# Altium project A4v3.PrjPcb
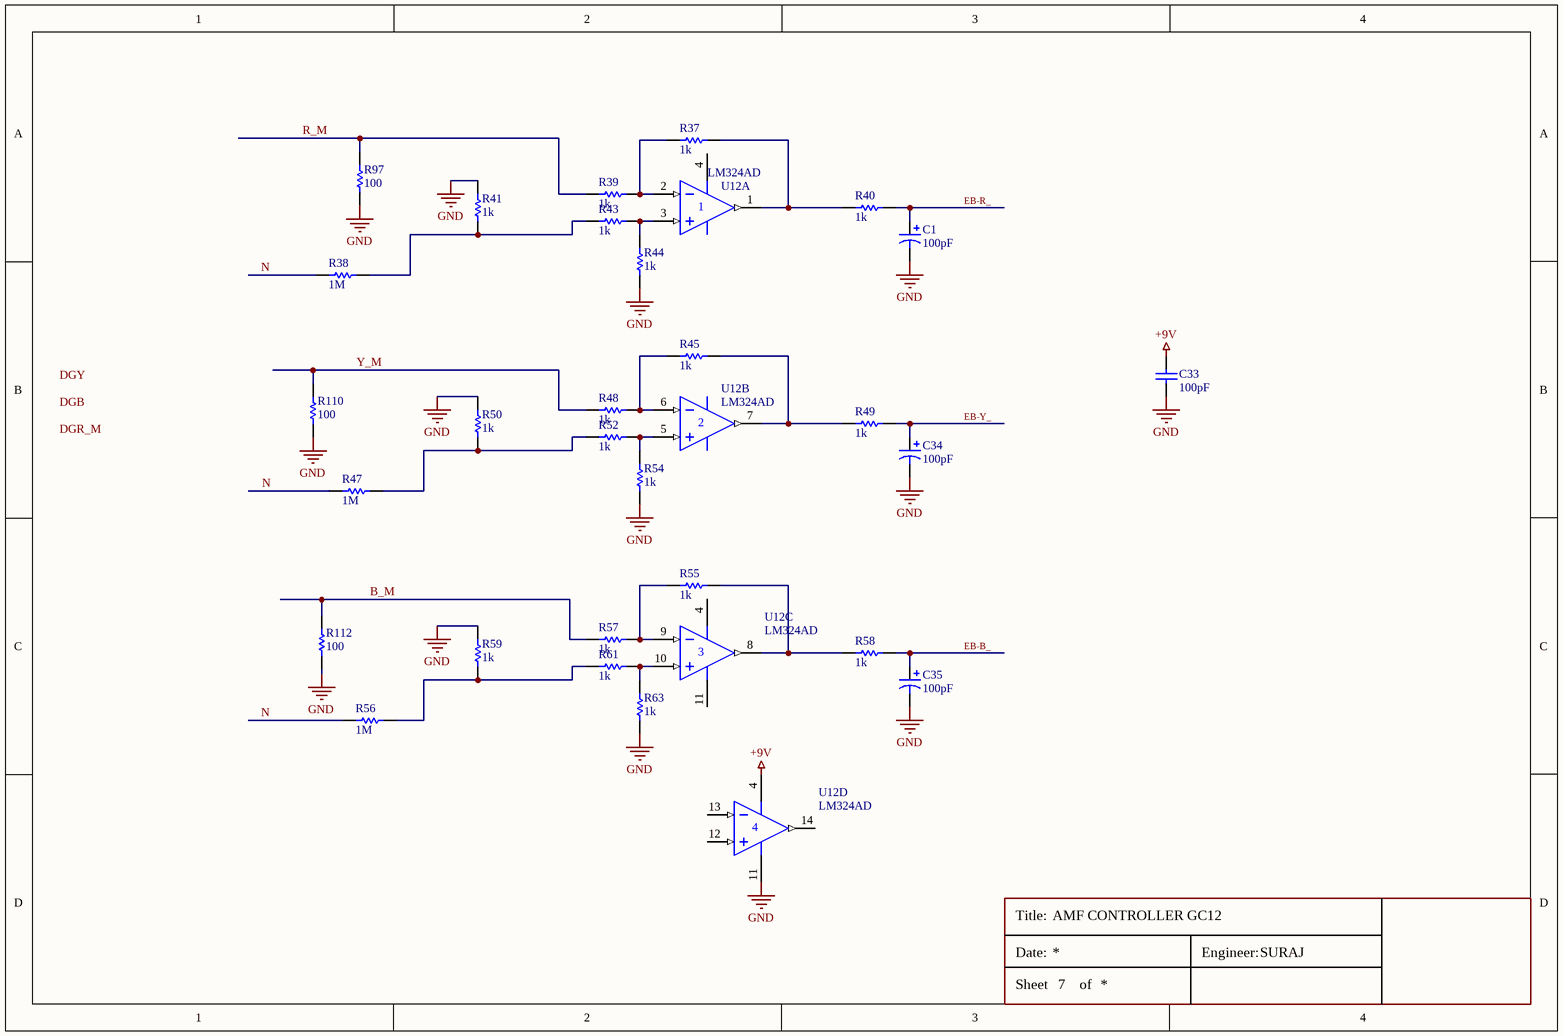
[diagram p0: AC.SchDoc]
4 sheets, 93 parts. Net scope: global (net labels, ports and power ports of the same name join across sheets).
Board file: A4.PcbDoc
Sheets:
  AC.SchDoc
  AC2.SchDoc
  BOTTOM.SchDoc
  SUPPLY.SchDoc

## Sheet AC.SchDoc: AMF CONTROLLER GC12
size A4; DrawnBy: SURAJ; Engineer: SURAJ; SheetNumber: 7

### Parts
C1  value 100pF  [Cap_.1]  (hidden comment: 10uF/63V)
C33  value 100pF  [C1206VW]  (hidden comment: .1uF 1206)
C34  value 100pF  [Cap_.1]  (hidden comment: 10uF/63V)
C35  value 100pF  [Cap_.1]  (hidden comment: 10uF/63V)
R37  value 1k  [R1206VW]  (hidden comment: 1M 1206)
R38  value 1M  [RES_RAD_1W]  (hidden comment: 1M MFR)
R39  value 1k  [R1206VW]  (hidden comment: 220K 1206)
R40  value 1k  [R1206VW]  (hidden comment: 33K 1206)
R41  value 1k  [R1206VW]  (hidden comment: 4.7K 1206)
R43  value 1k  [R1206VW]  (hidden comment: 220K 1206)
R44  value 1k  [R1206VW]  (hidden comment: 1M 1206)
R45  value 1k  [R1206VW]  (hidden comment: 1M 1206)
R47  value 1M  [RES_RAD_1W]  (hidden comment: 1M MFR)
R48  value 1k  [R1206VW]  (hidden comment: 220K 1206)
R49  value 1k  [R1206VW]  (hidden comment: 33K 1206)
R50  value 1k  [R1206VW]  (hidden comment: 4.7K 1206)
R52  value 1k  [R1206VW]  (hidden comment: 220K 1206)
R54  value 1k  [R1206VW]  (hidden comment: 1M 1206)
R55  value 1k  [R1206VW]  (hidden comment: 1M 1206)
R56  value 1M  [RES_RAD_1W]  (hidden comment: 1M MFR)
R57  value 1k  [R1206VW]  (hidden comment: 220K 1206)
R58  value 1k  [R1206VW]  (hidden comment: 33K 1206)
R59  value 1k  [R1206VW]  (hidden comment: 4.7K 1206)
R61  value 1k  [R1206VW]  (hidden comment: 220K 1206)
R63  value 1k  [R1206VW]  (hidden comment: 1M 1206)
R97  value 100  [R1206VW]  (hidden comment: 4.7K 1206)
R110  value 100  [R1206VW]  (hidden comment: 4.7K 1206)
R112  value 100  [R1206VW]  (hidden comment: 4.7K 1206)
U12  LM324AD  [D014_M]  (parts A,B,C,D of 4)

### Nets
+9V: C33.2 U12.4(V+)
GND: C1.2 C33.1 C34.2 C35.2 R41.2 R44.1 R50.2 R54.1 R59.2 R63.1 R97.1 R110.1 R112.1 U12.11(V-)
B_M: R57.2 R112.2
EB-B_: C35.1 R58.1
EB-R_: C1.1 R40.1
EB-Y_: C34.1 R49.1
N: R38.1 R47.1 R56.1
R_M: R39.2 R97.2
Y_M: R48.2 R110.2
NetR37_1: R37.1 R40.2 U12.1(OUT)
NetR37_2: R37.2 R39.1 U12.2(IN-)
NetR38_2: R38.2 R41.1 R43.2
NetR43_1: R43.1 R44.2 U12.3(IN+)
NetR45_1: R45.1 R49.2 U12.7(OUT)
NetR45_2: R45.2 R48.1 U12.6(IN-)
NetR47_2: R47.2 R50.1 R52.2
NetR52_1: R52.1 R54.2 U12.5(IN+)
NetR55_1: R55.1 R58.2 U12.8(OUT)
NetR55_2: R55.2 R57.1 U12.9(IN-)
NetR56_2: R56.2 R59.1 R61.2
NetR61_1: R61.1 R63.2 U12.10(IN+)

Not connected (* = marked no-connect by the designer): U12 12(IN+) 13(IN-) 14(OUT)

### Notes on the sheet
- Labels drawn without touching a wire or pin: DGB, DGR_M, DGY
- Title:
- Date:
- Sheet
- of
- Engineer:

### Library data of the parts
C1 C34 C35 = Cap Pol1: Polarized Capacitor (Radial); Published: 8-Jun-2000; LatestRevisionDate: 17-Jul-2002; LatestRevisionNote: Re-released for DXP Platform.; PackageReference: RB7.6-15; Publisher: Altium Limited; PackageDescription: Polarized Capacitor (Radial); 2 Leads
C33 = Cap: Capacitor; Published: 8-Jun-2000; LatestRevisionDate: 17-Jul-2002; LatestRevisionNote: Re-released for DXP Platform.; PackageReference: RAD-0.3; Publisher: Altium Limited; PackageDescription: Radial Cap, Thru-Hole; 2 Leads; 0.3 in Pin Spacing
R37-R41 R43-R45 R47-R50 R52 R54-R59 R61 R63 R97 R110 R112 = Res Semi: Semiconductor Resistor; Published: 8-Jun-2000; LatestRevisionDate: 17-Jul-2002; LatestRevisionNote: Re-released for DXP Platform.; PackageReference: AXIAL-0.5; Publisher: Altium Limited; PackageDescription: Axial Device, Thru-Hole; 2 Leads; 0.5 in Pin Spacing
U12 = LM324AD: Quadruple Operational Amplifier; Published: 15-Apr-2002; LatestRevisionDate: 13-Apr-2006; LatestRevisionNote: IPC-7351 Footprint Added.; DatasheetVersion: Jan-1989; PackageVersion: Jan-1998; PackageReference: D014; Publisher: Altium Limited; PackageDescription: 14-Pin Small Outline Integrated Circuit 1.27 mm Pitch; Code_IPC: SOIC127P600-14; ComponentLink1Description: Manufacturer Link; ComponentLink1URL: http://www.ti.com/; ComponentLink2Description: Datasheet; ComponentLink2URL: http://www-s.ti.com/sc/ds/lm324.pdf

## Sheet AC2.SchDoc: AMF CONTROLLER GC12
size A4; Author: SURAJ; CompanyName: SIMCONS; DrawnBy: SURAJ; Engineer: SURAJ; Organization: SIMCONS; Drawing TiTLE: SIMCONS AMF
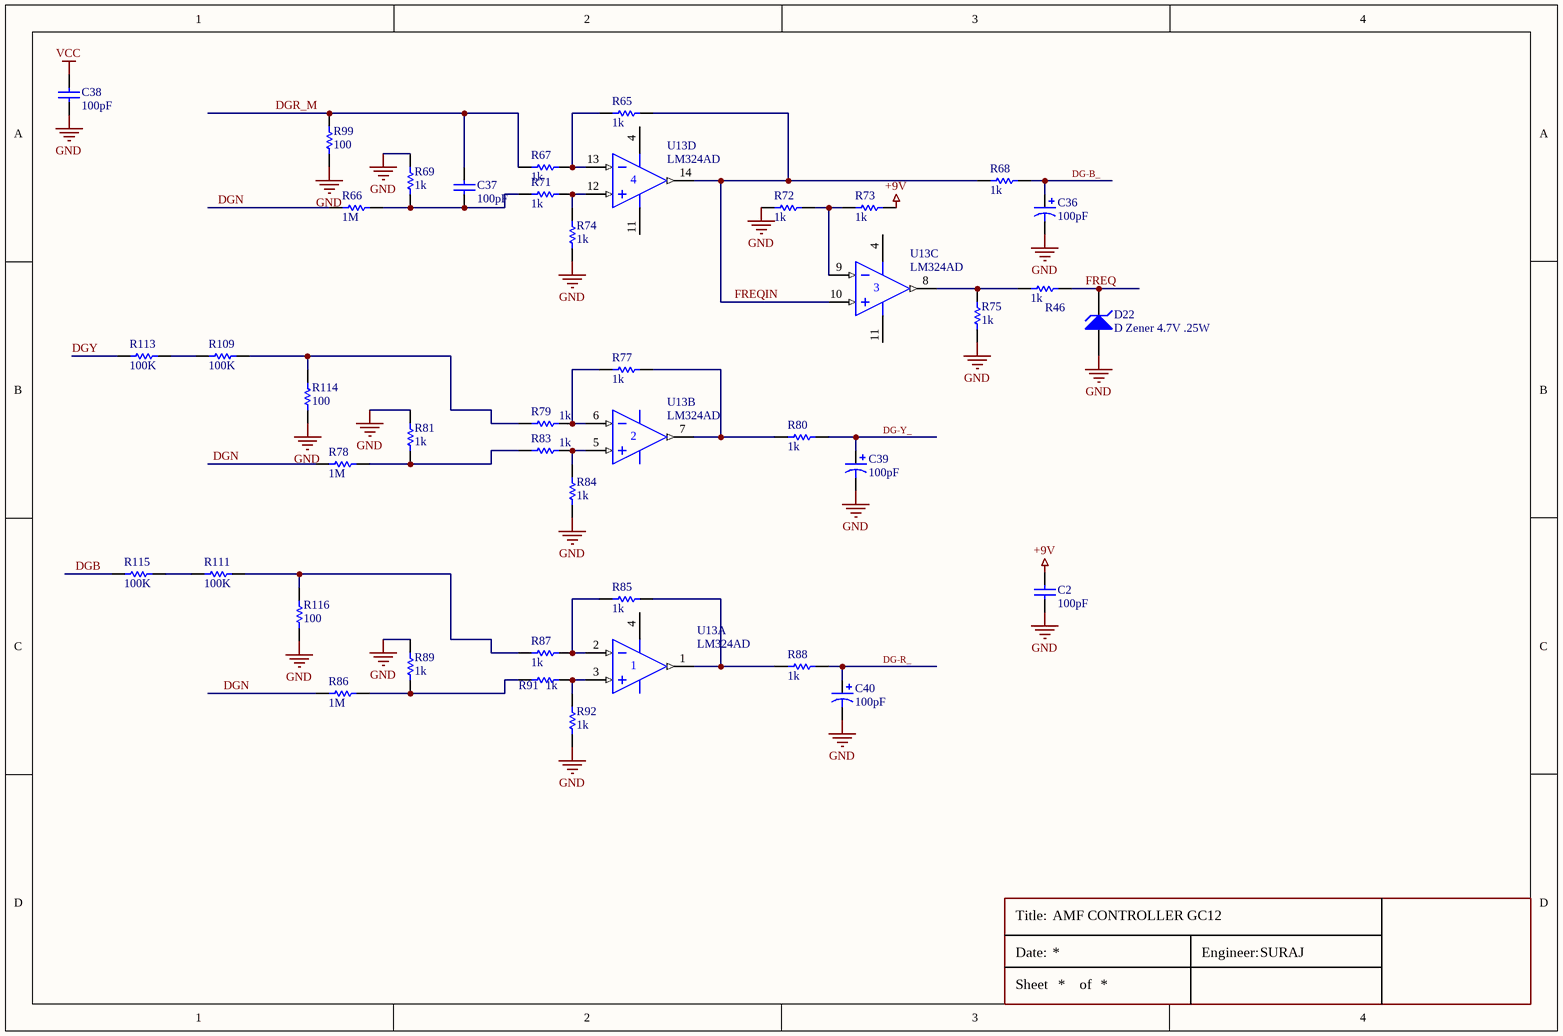
[diagram p1: AC2.SchDoc]

### Parts
C2  value 100pF  [C1206VW]  (hidden comment: .1uF 1206)
C36  value 100pF  [Cap_.1]  (hidden comment: 10uF/63V)
C37  value 100pF  [C1206VW]  (hidden comment: 22nF 1206)
C38  value 100pF  [C1206VW]  (hidden comment: .1uF 1206)
C39  value 100pF  [Cap_.1]  (hidden comment: 10uF/63V)
C40  value 100pF  [Cap_.1]  (hidden comment: 10uF/63V)
D22  D Zener 4.7V .25W  [DZENOR .25W]
R46  value 1k  [R1206VW]  (hidden comment: 470E 1206)
R65  value 1k  [R1206VW]  (hidden comment: 1M 1206)
R66  value 1M  [RES_RAD_1W]  (hidden comment: 1M MFR)
R67  value 1k  [R1206VW]  (hidden comment: 220K 1206)
R68  value 1k  [R1206VW]  (hidden comment: 33K 1206)
R69  value 1k  [R1206VW]  (hidden comment: 4.7K 1206)
R71  value 1k  [R1206VW]  (hidden comment: 220K 1206)
R72  value 1k  [R1206VW]  (hidden comment: 1K 1206)
R73  value 1k  [R1206VW]  (hidden comment: 10K 1206)
R74  value 1k  [R1206VW]  (hidden comment: 1M 1206)
R75  value 1k  [R1206VW]  (hidden comment: 10K 1206)
R77  value 1k  [R1206VW]  (hidden comment: 1M 1206)
R78  value 1M  [RES_RAD_1W]  (hidden comment: 1M MFR)
R79  value 1k  [R1206VW]  (hidden comment: 220K 1206)
R80  value 1k  [R1206VW]  (hidden comment: 33K 1206)
R81  value 1k  [R1206VW]  (hidden comment: 4.7K 1206)
R83  value 1k  [R1206VW]  (hidden comment: 220K 1206)
R84  value 1k  [R1206VW]  (hidden comment: 1M 1206)
R85  value 1k  [R1206VW]  (hidden comment: 1M 1206)
R86  value 1M  [RES_RAD_1W]  (hidden comment: 1M MFR)
R87  value 1k  [R1206VW]  (hidden comment: 220K 1206)
R88  value 1k  [R1206VW]  (hidden comment: 33K 1206)
R89  value 1k  [R1206VW]  (hidden comment: 4.7K 1206)
R91  value 1k  [R1206VW]  (hidden comment: 220K 1206)
R92  value 1k  [R1206VW]  (hidden comment: 1M 1206)
R99  value 100  [R1206VW]  (hidden comment: 4.7K 1206)
R109  value 100K  [AXIAL-0.5]  (hidden comment: MFR 1M .5W)
R111  value 100K  [AXIAL-0.5]  (hidden comment: MFR 1M .5W)
R113  value 100K  [AXIAL-0.5]  (hidden comment: MFR 1M .5W)
R114  value 100  [R1206VW]  (hidden comment: 4.7K 1206)
R115  value 100K  [AXIAL-0.5]  (hidden comment: MFR 1M .5W)
R116  value 100  [R1206VW]  (hidden comment: 4.7K 1206)
U13  LM324AD  [D014_M]  (parts A,B,C,D of 4)

### Nets
+9V: C2.2 R73.1 U13.4(V+)
GND: C2.1 C36.2 C38.1 C39.2 C40.2 D22.1(A) R69.2 R72.2 R74.1 R75.2 R81.2 R84.1 R89.2 R92.1 R99.1 R114.1 R116.1 U13.11(V-)
VCC: C38.2
DG-B_: C36.1 R68.1
DG-R_: C40.1 R88.1
DG-Y_: C39.1 R80.1
DGB: R115.1
DGN: R66.1 R78.1 R86.1
DGR_M: C37.2 R67.2 R99.2
DGY: R113.1
FREQ: D22.2(K) R46.2
FREQIN: R65.1 R68.2 U13.10(IN+) U13.14(OUT)
NetC37_1: C37.1 R66.2 R69.1 R71.2
NetR46_1: R46.1 R75.1 U13.8(OUT)
NetR65_2: R65.2 R67.1 U13.13(IN-)
NetR71_1: R71.1 R74.2 U13.12(IN+)
NetR72_1: R72.1 R73.2 U13.9(IN-)
NetR77_1: R77.1 R80.2 U13.7(OUT)
NetR77_2: R77.2 R79.1 U13.6(IN-)
NetR78_2: R78.2 R81.1 R83.2
NetR79_2: R79.2 R109.2 R114.2
NetR83_1: R83.1 R84.2 U13.5(IN+)
NetR85_1: R85.1 R88.2 U13.1(OUT)
NetR85_2: R85.2 R87.1 U13.2(IN-)
NetR86_2: R86.2 R89.1 R91.2
NetR87_2: R87.2 R111.2 R116.2
NetR91_1: R91.1 R92.2 U13.3(IN+)
NetR109_1: R109.1 R113.2
NetR111_1: R111.1 R115.2

### Notes on the sheet
- Title:
- Date:
- Sheet
- of
- Engineer:

### Library data of the parts
C2 C37 C38 = Cap: Capacitor; Published: 8-Jun-2000; LatestRevisionDate: 17-Jul-2002; LatestRevisionNote: Re-released for DXP Platform.; PackageReference: RAD-0.3; Publisher: Altium Limited; PackageDescription: Radial Cap, Thru-Hole; 2 Leads; 0.3 in Pin Spacing
C36 C39 C40 = Cap Pol1: Polarized Capacitor (Radial); Published: 8-Jun-2000; LatestRevisionDate: 17-Jul-2002; LatestRevisionNote: Re-released for DXP Platform.; PackageReference: RB7.6-15; Publisher: Altium Limited; PackageDescription: Polarized Capacitor (Radial); 2 Leads
D22 = D Zener: Zener Diode; Published: 8-Jun-2000; LatestRevisionDate: 17-Jul-2002; LatestRevisionNote: Re-released for DXP Platform.; PackageReference: DIODE-0.7; Publisher: Altium Limited; PackageDescription: Diode, Thru-Hole; 2 Leads; 0.7 in Pin Spacing
R46 R65-R69 R71-R75 R77-R81 R83-R89 R91 R92 R99 R109 R111 R113-R116 = Res Semi: Semiconductor Resistor; Published: 8-Jun-2000; LatestRevisionDate: 17-Jul-2002; LatestRevisionNote: Re-released for DXP Platform.; PackageReference: AXIAL-0.5; Publisher: Altium Limited; PackageDescription: Axial Device, Thru-Hole; 2 Leads; 0.5 in Pin Spacing
U13 = LM324AD: Quadruple Operational Amplifier; Published: 15-Apr-2002; LatestRevisionDate: 13-Apr-2006; LatestRevisionNote: IPC-7351 Footprint Added.; DatasheetVersion: Jan-1989; PackageVersion: Jan-1998; PackageReference: D014; Publisher: Altium Limited; PackageDescription: 14-Pin Small Outline Integrated Circuit 1.27 mm Pitch; Code_IPC: SOIC127P600-14; ComponentLink1Description: Manufacturer Link; ComponentLink1URL: http://www.ti.com/; ComponentLink2Description: Datasheet; ComponentLink2URL: http://www-s.ti.com/sc/ds/lm324.pdf

## Sheet BOTTOM.SchDoc: AMF CONTROLLER GC12
size A4; DrawnBy: SURAJ; Engineer: SURAJ; SheetNumber: 8
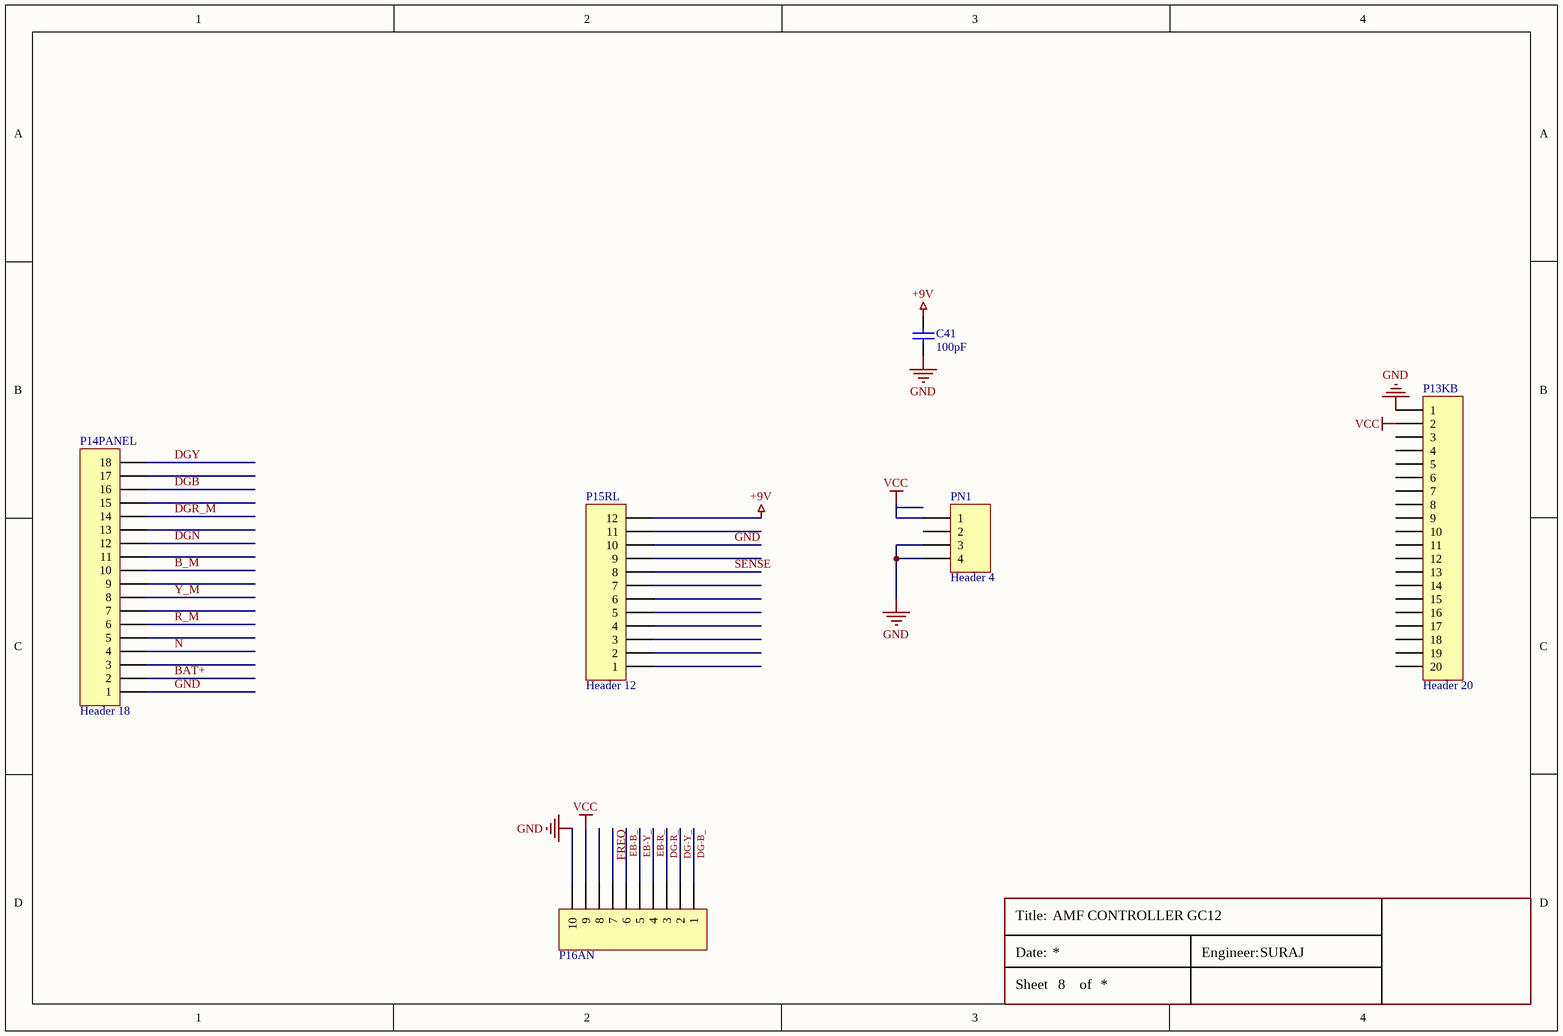
[diagram p2: BOTTOM.SchDoc]

### Parts
C41  value 100pF  [C1206VW]  (hidden comment: .1uF 1206)
P13KB  Header 20  [HDR1X20_BURGE_F]
P14PANEL  Header 18  [HDR1X18_BURGE_F]
P15RL  Header 12  [HDR1X12_BURGE_F]
P16AN  Header 10  [HDR1X10_BURGE_F]  (value not drawn)
PN1  Header 4  [HDR1X4_BURGE_F]

### Nets
+9V: C41.2 P15RL.12
GND: C41.1 P13KB.1 P14PANEL.1 P15RL.10 P16AN.10 PN1.3 PN1.4
VCC: P13KB.2 P16AN.9 PN1.1
B_M: P14PANEL.10
BAT+: P14PANEL.2
DG-B_: P16AN.1
DG-R_: P16AN.3
DG-Y_: P16AN.2
DGB: P14PANEL.16
DGN: P14PANEL.12
DGR_M: P14PANEL.14
DGY: P14PANEL.18
EB-B_: P16AN.6
EB-R_: P16AN.4
EB-Y_: P16AN.5
FREQ: P16AN.7
N: P14PANEL.4
R_M: P14PANEL.6
SENSE: P15RL.8
Y_M: P14PANEL.8

Not connected (* = marked no-connect by the designer): P13KB 3 4 5 6 7 8 9 10 11 12 13 14 15 16 17 18 19 20; P14PANEL 3 5 7 9 11 13 15 17; P15RL 1 2 3 4 5 6 7 9 11; P16AN 8; PN1 2

### Notes on the sheet
- Title:
- Date:
- Sheet
- of
- Engineer:

### Library data of the parts
C41 = Cap: Capacitor; Published: 8-Jun-2000; LatestRevisionDate: 17-Jul-2002; LatestRevisionNote: Re-released for DXP Platform.; PackageReference: RAD-0.3; Publisher: Altium Limited; PackageDescription: Radial Cap, Thru-Hole; 2 Leads; 0.3 in Pin Spacing
P13KB = Header 20: Header, 20-Pin; LatestRevisionDate: 17-Jul-2002; LatestRevisionNote: Re-released for DXP Platform.; Publisher: Altium Limited
P14PANEL = Header 18: Header, 18-Pin; LatestRevisionDate: 17-Jul-2002; LatestRevisionNote: Re-released for DXP Platform.; Publisher: Altium Limited
P15RL = Header 12: Header, 12-Pin; LatestRevisionDate: 17-Jul-2002; LatestRevisionNote: Re-released for DXP Platform.; Publisher: Altium Limited
P16AN = Header 10: Header, 10-Pin; LatestRevisionDate: 17-Jul-2002; LatestRevisionNote: Re-released for DXP Platform.; Publisher: Altium Limited
PN1 = Header 4: Header, 4-Pin; LatestRevisionDate: 17-Jul-2002; LatestRevisionNote: Re-released for DXP Platform.; Publisher: Altium Limited

## Sheet SUPPLY.SchDoc: AMF CONTROLELR GC12
size A4; DrawnBy: SURAJ; Engineer: SURAJ; SheetNumber: 9
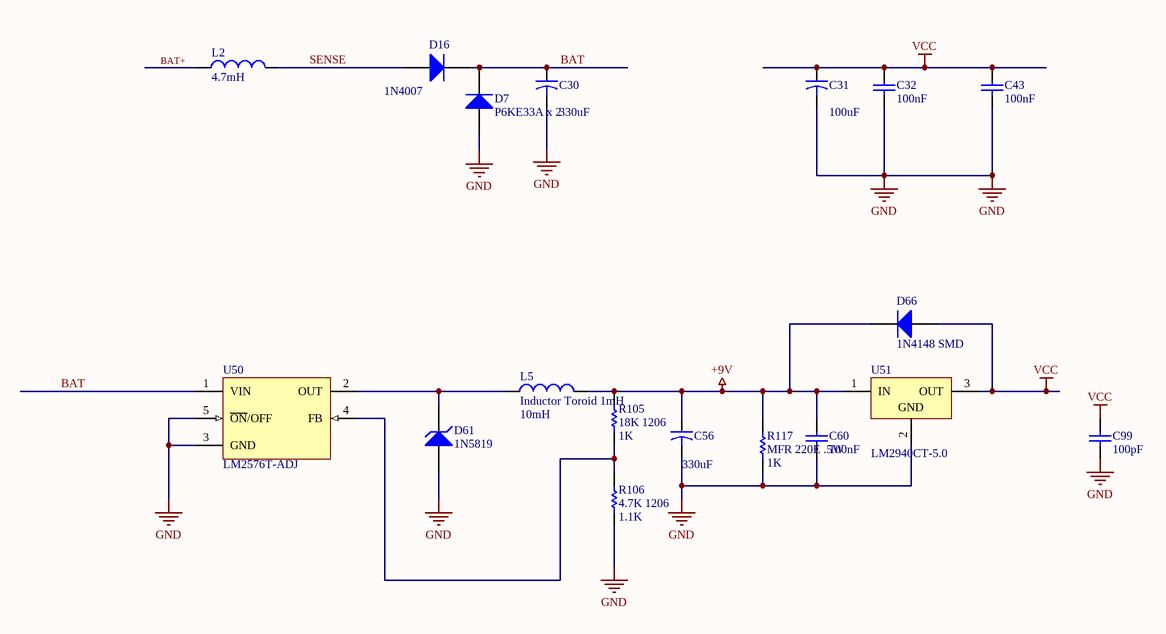
[diagram p3: SUPPLY.SchDoc]

### Parts
C30  value 330uF  [Cap_.2-2]  (hidden comment: Cap Electrolitic 1000uF/50V)
C31  value 100uF  [Cap_.2]  (hidden comment: Cap Electrolytic 470uF/16V)
C32  value 100nF  [C1206VW]  (hidden comment: .1uF 1206)
C43  value 100nF  [C1206VW]  (hidden comment: 1uF 1206)
C56  value 330uF  [Cap_.3]  (hidden comment: Cap Electrolitic 3300uF/16V)
C60  value 100nF  [C1206VW]  (hidden comment: .1uF 1206)
C99  value 100pF  [C1206VW]  (hidden comment: .1uF 1206)
D7  P6KE33A x 2  [DIODE1A]
D16  1N4007  [DIODE1A]
D61  1N5819  [DIODE1A]
D66  1N4148 SMD  [4148SMD]
L2  value 4.7mH  [INDUCTOR]  (hidden comment: Inductor 220uH)
L5  Inductor Toroid 1mH  value 10mH  [INDUCTORTOROID]
R105  18K 1206  value 1K  [R1206VW]
R106  4.7K 1206  value 1.1K  [R1206VW]
R117  MFR 220E .5W  value 1K  [AXIAL-0.5]
U50  LM2576T-ADJ  [T05D]
U51  LM2940CT-5.0  [T03B]

### Nets
+9V: C56.1 C60.2 D66.2(K) L5.2 R105.2 R117.2 U51.1(IN)
GND: C30.2 C31.2 C32.1 C43.1 C56.2 C60.1 C99.1 D7.1(A) D61.1(A) R106.1 R117.1 U50.3(GND) U50.5(~{ON}/OFF) U51.2(GND)
VCC: C31.1 C32.2 C43.2 C99.2 D66.1(A) U51.3(OUT)
BAT: C30.1 D7.2(K) D16.2(K) U50.1(VIN)
BAT+: L2.1
SENSE: D16.1(A) L2.2
NetD61_2: D61.2(K) L5.1 U50.2(OUT)
NetR105_1: R105.1 R106.2 U50.4(FB)

### Notes on the sheet
- Title:
- Date:
- Sheet
- of
- Engineer:

### Library data of the parts
C30 C31 C56 = Cap2: Capacitor; Published: 23-Sep-2002; PackageReference: CAPR5-4X5; Publisher: Altium Limited
C32 C43 C60 = CAP: Capacitor; Published: 8-Jun-2000; LatestRevisionDate: 17-Jul-2002; LatestRevisionNote: Re-released for DXP Platform.; PackageReference: RAD-0.3; Publisher: Altium Limited; PackageDescription: Radial Cap, Thru-Hole; 2 Leads; 0.3 in Pin Spacing
C99 = Cap: Capacitor; Published: 8-Jun-2000; LatestRevisionDate: 17-Jul-2002; LatestRevisionNote: Re-released for DXP Platform.; PackageReference: RAD-0.3; Publisher: Altium Limited; PackageDescription: Radial Cap, Thru-Hole; 2 Leads; 0.3 in Pin Spacing
D7 D16 = Diode 1N5408: 3 Amp Medium Power Silicon Rectifier Diode; Published: 8-Jun-2000; LatestRevisionDate: 17-Jul-2002; LatestRevisionNote: Re-released for DXP Platform.; DatasheetVersion: Aug-1984; PackageReference: DO-201AD; Publisher: Altium Limited; PackageDescription: Diode, Axial; Body 9.5 x 5.3 mm (LxDia. max), Lead Dia. 1.32 mm (max); ComponentLink1Description: Manufacturer Link; ComponentLink1URL: http://www.irf.com/
D61 = 1N5221B: Silicon Zener Diode (0.3 to 0.5W); Published: 8-Jun-2000; LatestRevisionDate: 17-Jul-2002; LatestRevisionNote: Re-released for DXP Platform.; DatasheetDocument: 6-Aug-1999; PackageReference: DO-35; Publisher: Altium Limited; Code_JEDEC: DO-204-AH; ComponentLink1Description: Manufacturer Link; ComponentLink1URL: http://www.vishay.com/; ComponentLink2Description: Datasheet; ComponentLink2URL: http://www.vishay.com/docs/85588/85588.pdf
D66 = Diode 1N5408: Small Signal Fast Switching Diode; Published: 8-Jun-2000; LatestRevisionDate: 17-Jul-2002; LatestRevisionNote: Re-released for DXP Platform.; DatasheetVersion: Aug-1984; PackageReference: DO-201AD; Publisher: Altium Limited; PackageDescription: Diode, Axial; Body 9.5 x 5.3 mm (LxDia. max), Lead Dia. 1.32 mm (max); ComponentLink1Description: Manufacturer Link; ComponentLink1URL: http://www.irf.com/
L2 L5 = Inductor: Code_IEC: 1005; Published: 8-Jun-2000; LatestRevisionDate: 29-May-2009; LatestRevisionNote: IPC-7351 Footprint Added.; PackageReference: 0402-A; Publisher: Altium Limited; PackageDescription: Chip Inductor; Code_JEITA: 0402
R105 R106 = Res SMT: Semiconductor Resistor; Published: 8-Jun-2000; LatestRevisionDate: 17-Jul-2002; LatestRevisionNote: Re-released for DXP Platform.; PackageReference: AXIAL-0.5; Publisher: Altium Limited; PackageDescription: Axial Device, Thru-Hole; 2 Leads; 0.5 in Pin Spacing
R117 = Res Semi: Semiconductor Resistor; Published: 8-Jun-2000; LatestRevisionDate: 17-Jul-2002; LatestRevisionNote: Re-released for DXP Platform.; PackageReference: AXIAL-0.5; Publisher: Altium Limited; PackageDescription: Axial Device, Thru-Hole; 2 Leads; 0.5 in Pin Spacing
U50 = LM2576T-ADJ: SIMPLE SWITCHER® 3A Step-Down Voltage Regulator, 5-pin TO-220; Manufacturer: National Semiconductor; PackageTopMarking: NSUZXYTTE#*LM2576T*-ADJ P+; PowerWise: N; Published: 4-Dec-2008; DatasheetVersion: Aug-2004; PackageVersion: revJ, Jan-1992; PackageReference: T05A; Publisher: Altium Limited; PackageDescription: TO-220, Molded, 5 Lead, Straight; Supplier 1: Farnell; Supplier Part Number 1: 9488146; PartNumber: LM2576T-ADJ; RoHS: N; PinCount: 5; CompType: Switcher; Code_JEDEC: TO-220-AB; ComponentLink1Description: LM2576 Datasheet; ComponentLink1URL: http://www.national.com/ds/LM/LM2576.pdf; ComponentLink2Description: LM2576 Web Page; ComponentLink2URL: http://www.national.com/pf/LM/LM2576.html; ComponentLink3Description: T05A Package Page; ComponentLink3URL: http://www.national.com/packaging/folders/t05a.html
U51 = LM2940CT-5.0: 1A Low Dropout Regulator, 3-pin TO-220; Manufacturer: National Semiconductor; PackageTopMarking: NSUZXYTTE#*LM2940CT*-5.0 P+; PowerWise: N; CompType: LDO IC; Published: 4-Dec-2008; DatasheetVersion: Jan-2007; PackageVersion: revL, Jan-1992; PackageReference: T03B; Publisher: Altium Limited; PackageDescription: TO-220, Molded, 3 Lead, Straight; Supplier 1: Farnell; Supplier Part Number 1: 9490191; Supplier 2: Farnell; Supplier Part Number 2: 1523853; PartNumber: LM2940CT-5.0; RoHS: N; PinCount: 3; ComponentLink1Description: LM2940C Datasheet; ComponentLink1URL: http://www.national.com/ds/LM/LM2940C.pdf; ComponentLink2Description: LM2940C Web Page; ComponentLink2URL: http://www.national.com/pf/LM/LM2940C.html; ComponentLink3Description: T03B Package Page; ComponentLink3URL: http://www.national.com/packaging/folders/t03b.html

## Nets that join several sheets
+9V: AC (C33.2 U12.4), AC2 (C2.2 R73.1 U13.4), BOTTOM (C41.2 P15RL.12), SUPPLY (7 pins)
GND: AC (14 pins), AC2 (18 pins), BOTTOM (7 pins), SUPPLY (14 pins)
VCC: AC2 (C38.2), BOTTOM (P13KB.2 P16AN.9 PN1.1), SUPPLY (6 pins)
B_M: AC (R57.2 R112.2), BOTTOM (P14PANEL.10)
BAT+: BOTTOM (P14PANEL.2), SUPPLY (L2.1)
DG-B_: AC2 (C36.1 R68.1), BOTTOM (P16AN.1)
DG-R_: AC2 (C40.1 R88.1), BOTTOM (P16AN.3)
DG-Y_: AC2 (C39.1 R80.1), BOTTOM (P16AN.2)
DGB: AC2 (R115.1), BOTTOM (P14PANEL.16)
DGN: AC2 (R66.1 R78.1 R86.1), BOTTOM (P14PANEL.12)
DGR_M: AC2 (C37.2 R67.2 R99.2), BOTTOM (P14PANEL.14)
DGY: AC2 (R113.1), BOTTOM (P14PANEL.18)
EB-B_: AC (C35.1 R58.1), BOTTOM (P16AN.6)
EB-R_: AC (C1.1 R40.1), BOTTOM (P16AN.4)
EB-Y_: AC (C34.1 R49.1), BOTTOM (P16AN.5)
FREQ: AC2 (D22.2 R46.2), BOTTOM (P16AN.7)
N: AC (R38.1 R47.1 R56.1), BOTTOM (P14PANEL.4)
R_M: AC (R39.2 R97.2), BOTTOM (P14PANEL.6)
SENSE: BOTTOM (P15RL.8), SUPPLY (D16.1 L2.2)
Y_M: AC (R48.2 R110.2), BOTTOM (P14PANEL.8)